# Altium schematic sheet Sheet1.SchDoc
size A4
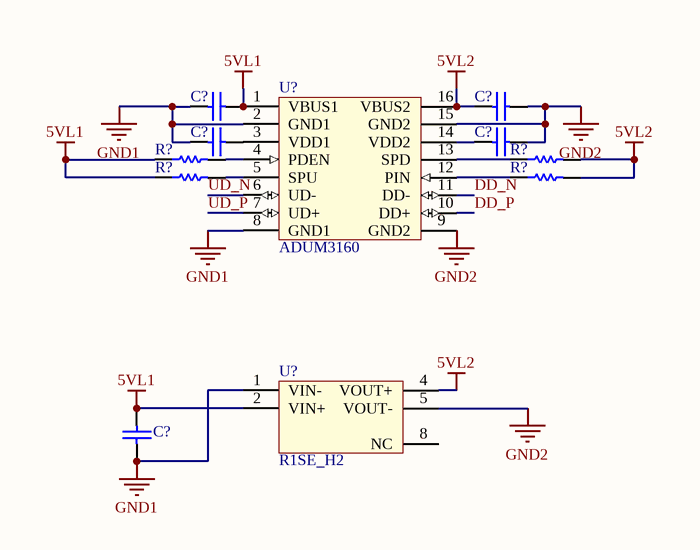
[diagram p0: Sheet1.SchDoc]

## Parts
(Parts that share a designator on the sheet are numbered #1, #2 ... from top to bottom, then left to right.)
C?#1  Cap  [CAPC1608X90N]  (value not drawn)
C?#2  Cap  [CAPC1608X90N]  (value not drawn)
C?#3  Cap  [CAPC1608X90N]  (value not drawn)
C?#4  Cap  [CAPC1608X90N]  (value not drawn)
C?#5  Cap  [CAPC2012X135N]  (value not drawn)
R?#1  Res1  [RESC2012X70N]  (value not drawn)
R?#2  Res1  [RESC2012X70N]  (value not drawn)
R?#3  Res1  [RESC2012X70N]  (value not drawn)
R?#4  Res1  [RESC2012X70N]  (value not drawn)
U?#1  ADUM3160  [SOIC_W_16]
U?#2  R1SE_H2  [R1SE_H2]

## Nets
5VL1: C?#1.2 C?#5.2 R?#1.1 R?#3.1 U?#1.1(VBUS1) U?#2.2(VIN+)
5VL2: C?#2.1 R?#2.2 R?#4.2 U?#1.16(VBUS2) U?#2.4(VOUT+)
GND1: C?#1.1 C?#3.1 C?#5.1 U?#1.2(GND1) U?#1.8(GND1) U?#2.1(VIN-)
GND2: C?#2.2 C?#4.2 U?#1.9(GND2) U?#1.15(GND2) U?#2.5(VOUT-)
DD_N: U?#1.11(DD-)
DD_P: U?#1.10(DD+)
UD_N: U?#1.6(UD-)
UD_P: U?#1.7(UD+)
NetC?#3_2: C?#3.2 U?#1.3(VDD1)
NetC?#4_1: C?#4.1 U?#1.14(VDD2)
NetR?#1_2: R?#1.2 U?#1.4(PDEN)
NetR?#2_1: R?#2.1 U?#1.13(SPD)
NetR?#3_2: R?#3.2 U?#1.5(SPU)
NetR?#4_1: R?#4.1 U?#1.12(PIN)

Not connected (* = marked no-connect by the designer): U?#2 8(NC)

## Library data of the parts
C?#1-C?#5 = Cap: Capacitor; Value: 10n; Published: 8-Jun-2000; LatestRevisionDate: 17-Jul-2002; LatestRevisionNote: Re-released for DXP Platform.; PackageReference: RAD-0.3; Publisher: Altium Limited; PackageDescription: Radial Cap, Thru-Hole; 2 Leads; 0.3 in Pin Spacing
R?#1-R?#4 = Res1: Resistor; Value: 4K7; Published: 8-Jun-2000; LatestRevisionDate: 17-Jul-2002; LatestRevisionNote: Re-released for DXP Platform.; PackageReference: AXIAL-0.3; Publisher: Altium Limited; PackageDescription: Axial Device, Thru-Hole; 2 Leads; 0.3 in Pin Spacing
U?#1 = ADUM3160: 2.5kV USB isolator
U?#2 = R1SE_H2: R1SE_H2, isolated DC/DC converter 5V to 5V 1W